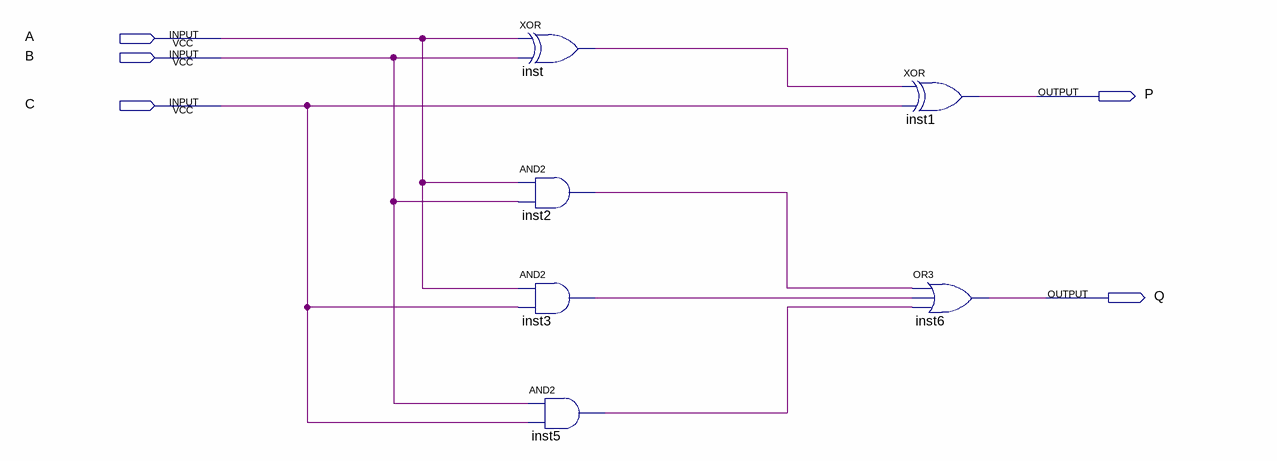
[diagram p0: schematic sheet]
// Quartus schematic FullAdder.bdf as structural Verilog: 6 symbols, 5 pins
module FullAdder (
  input  A,
  input  B,
  input  C,
  output P,
  output Q
);

  wire inst2_out, inst3_out, inst5_out, inst_out;

  xor inst (inst_out, A, B);
  and inst2 (inst2_out, A, B);
  and inst3 (inst3_out, A, C);
  and inst5 (inst5_out, B, C);
  xor inst1 (P, inst_out, C);
  or inst6 (Q, inst2_out, inst3_out, inst5_out);
endmodule
